# EAGLE design PoE_Mag-revF (EAGLE 8.6.3)
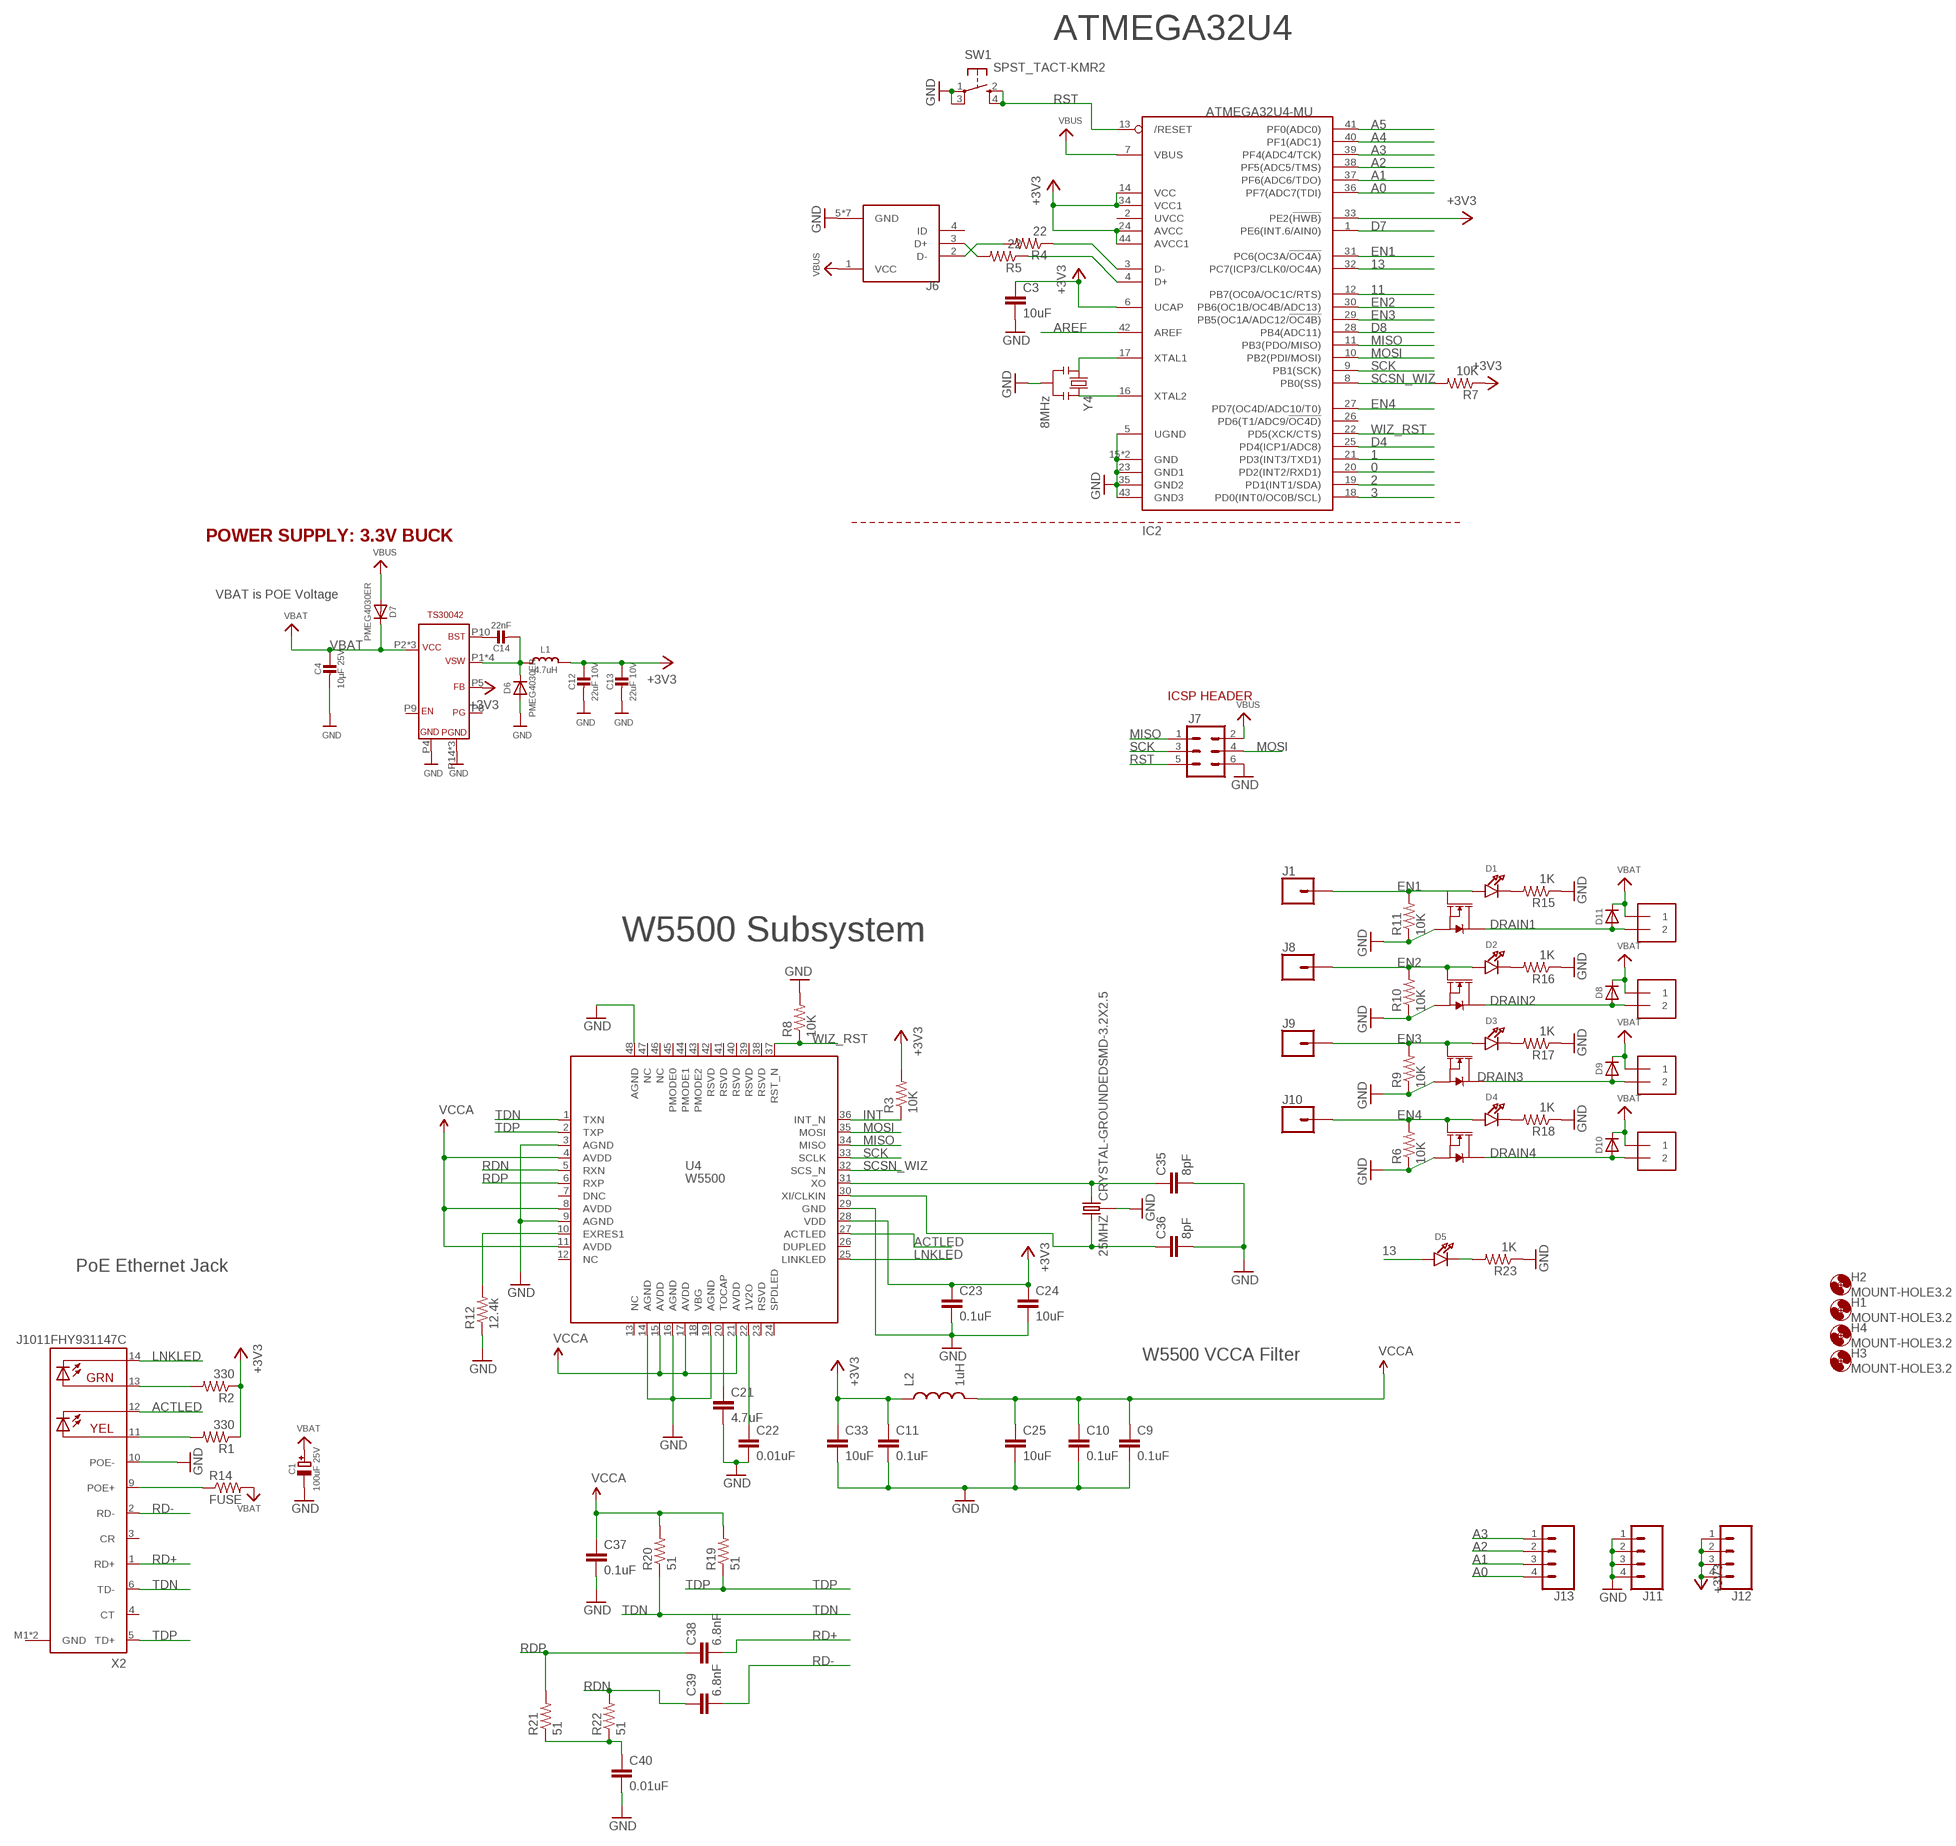
[diagram p0: schematic, sheet 1]

## Parts
25MHZ  CRYSTAL-GROUNDEDSMD-3.2X2.5  [CRYSTAL-SMD-3.2X2.5MM]
C1  100uF 25V  CAP_ELECTROLYTICPANASONIC_D  [PANASONIC_D]
C3  10uF  CAP0603-CAP  [0603-CAP]
C4  10µF 25V  CAP_CERAMIC0603MINI  [0603-MINI]
C9  0.1uF  CAP0603-CAP  [0603-CAP]
C10  0.1uF  CAP0603-CAP  [0603-CAP]
C11  0.1uF  CAP0603-CAP  [0603-CAP]
C12  22uF 10V  CAP_CERAMIC0603MINI  [0603-MINI]
C13  22uF 10V  CAP_CERAMIC0603MINI  [0603-MINI]
C14  22nF  CAP_CERAMIC0603MINI  [0603-MINI]
C21  4.7uF  CAP0603-CAP  [0603-CAP]
C22  0.01uF  CAP0603-CAP  [0603-CAP]
C23  0.1uF  CAP0603-CAP  [0603-CAP]
C24  10uF  CAP0603-CAP  [0603-CAP]
C25  10uF  CAP0603-CAP  [0603-CAP]
C33  10uF  CAP0603-CAP  [0603-CAP]
C35  8pF  CAP0603-CAP  [0603-CAP]
C36  8pF  CAP0603-CAP  [0603-CAP]
C37  0.1uF  CAP0603-CAP  [0603-CAP]
C38  6.8nF  CAP0603-CAP  [0603-CAP]
C39  6.8nF  CAP0603-CAP  [0603-CAP]
C40  0.01uF  CAP0603-CAP  [0603-CAP]
D1  LED0805_NOOUTLINE  [CHIPLED_0805_NOOUTLINE]
D2  LED0805_NOOUTLINE  [CHIPLED_0805_NOOUTLINE]
D3  LED0805_NOOUTLINE  [CHIPLED_0805_NOOUTLINE]
D4  LED0805_NOOUTLINE  [CHIPLED_0805_NOOUTLINE]
D5  LED0805_NOOUTLINE  [CHIPLED_0805_NOOUTLINE]
D6  PMEG4030ER  DIODESOD-123  [SOD-123]
D7  PMEG4030ER  DIODESOD-123  [SOD-123]
D8  DIODESOD-123  [SOD-123]
D9  DIODESOD-123  [SOD-123]
D10  DIODESOD-123  [SOD-123]
D11  DIODESOD-123  [SOD-123]
H1  MOUNT-HOLE3.2  [3,2]
H2  MOUNT-HOLE3.2  [3,2]
H3  MOUNT-HOLE3.2  [3,2]
H4  MOUNT-HOLE3.2  [3,2]
IC2  ATMEGA32U4-MU  [TQFN44_7MM]
J1  CONN_01  [1X01]
J2  1X2-3.5MM  [1X2-3.5MM]
J3  1X2-3.5MM  [1X2-3.5MM]
J4  1X2-3.5MM  [1X2-3.5MM]
J5  1X2-3.5MM  [1X2-3.5MM]
J6  10103594-0001LF  [FCI_10103594-0001LF]
J7  CONN_03X2NO_SILK  [2X3-NS]
J8  CONN_01  [1X01]
J9  CONN_01  [1X01]
J10  CONN_01  [1X01]
J11  CONN_04  [1X04]
J12  CONN_04  [1X04]
J13  CONN_041X04_NO_SILK  [1X04_NO_SILK]
L1  4.7uH  INDUCTORTDK_VLC5045  [INDUCTOR_5X5MM_TDK_VLC5045]
L2  1uH  INDUCTOR0603  [0603]
Q1  35A/25V/8.5mΩ  MOSFET-NCH-FDD8780  [DPAK]
Q3  35A/25V/8.5mΩ  MOSFET-NCH-FDD8780  [DPAK]
Q5  35A/25V/8.5mΩ  MOSFET-NCH-FDD8780  [DPAK]
Q6  35A/25V/8.5mΩ  MOSFET-NCH-FDD8780  [DPAK]
R1  330  RESISTOR0603-RES  [0603-RES]
R2  330  RESISTOR0603-RES  [0603-RES]
R3  10K  RESISTOR0603-RES  [0603-RES]
R4  22  RESISTOR0603-RES  [0603-RES]
R5  22  RESISTOR0603-RES  [0603-RES]
R6  10K  RESISTOR0603-RES  [0603-RES]
R7  10K  RESISTOR0603-RES  [0603-RES]
R8  10K  RESISTOR0603-RES  [0603-RES]
R9  10K  RESISTOR0603-RES  [0603-RES]
R10  10K  RESISTOR0603-RES  [0603-RES]
R11  10K  RESISTOR0603-RES  [0603-RES]
R12  12.4k  RESISTOR0603-RES  [0603-RES]
R14  FUSE  RESISTOR0603-RES  [0603-RES]
R15  1K  RESISTOR0603-RES  [0603-RES]
R16  1K  RESISTOR0603-RES  [0603-RES]
R17  1K  RESISTOR0603-RES  [0603-RES]
R18  1K  RESISTOR0603-RES  [0603-RES]
R19  51  RESISTOR0603-RES  [0603-RES]
R20  51  RESISTOR0603-RES  [0603-RES]
R21  51  RESISTOR0603-RES  [0603-RES]
R22  51  RESISTOR0603-RES  [0603-RES]
R23  1K  RESISTOR0603-RES  [0603-RES]
SW1  SPST_TACT-KMR2  [KMR2]
U4  W5500  [W5500]
U$19  BUCK_CONVERTER  [QFN-16]
X2  J1011FHY931147C  [HANRUN_POE]
Y4  8MHz  RESONATORSMD  [RESONATOR-SMD]

## Nets
0: IC2.20(PD2(INT2/RXD1))
1: IC2.21(PD3(INT3/TXD1))
2: IC2.19(PD1(INT1/SDA))
3: IC2.18(PD0(INT0/OC0B/SCL))
11: IC2.12(PB7(OC0A/OC1C/RTS))
13: D5.A IC2.32(PC7(ICP3/CLK0/OC4A))
+3V3: C3.1 C11.1 C12.1 C13.1 C23.1 C24.1 C33.1 IC2.6(UCAP) IC2.14(VCC) IC2.24(AVCC) IC2.33(PE2(!HWB)) IC2.34(VCC1) IC2.44(AVCC1) J12.1 J12.2 J12.3 J12.4 L1.P$2 L2.1 R1.1 R2.1 R3.2 R7.1 U4.28(VDD) U$19.P5(FB)
A0: IC2.36(PF7(ADC7(TDI)) J13.4
A1: IC2.37(PF6(ADC6/TDO)) J13.3
A2: IC2.38(PF5(ADC5/TMS)) J13.2
A3: IC2.39(PF4(ADC4/TCK)) J13.1
A4: IC2.40(PF1(ADC1))
A5: IC2.41(PF0(ADC0))
ACTLED: U4.27(ACTLED) X2.12(YEL-C)
AREF: IC2.42(AREF)
D4: IC2.25(PD4(ICP1/ADC8))
D7: IC2.1(PE6(INT.6/AIN0))
D8: IC2.28(PB4(ADC11))
D+: IC2.4(D+) R5.1
D-: IC2.3(D-) R4.1
DRAIN1: D11.A J2.2 Q1.4(D)
DRAIN2: D8.A J3.2 Q3.4(D)
DRAIN3: D9.A J4.2 Q5.4(D)
DRAIN4: D10.A J5.2 Q6.4(D)
EN1: D1.A IC2.31(PC6(OC3A/!OC4A)) J1.1 Q1.1(G) R11.2
EN2: D2.A IC2.30(PB6(OC1B/OC4B/ADC13)) J8.1 Q3.1(G) R10.2
EN3: D3.A IC2.29(PB5(OC1A/ADC12/!OC4B)) J9.1 Q5.1(G) R9.2
EN4: D4.A IC2.27(PD7(OC4D/ADC10/T0)) J10.1 Q6.1(G) R6.2
GND: 25MHZ.2 25MHZ.4 C1.- C3.2 C4.2 C9.2 C10.2 C11.2 C12.2 C13.2 C21.2 C22.2 C23.2 C24.2 C25.2 C33.2 C35.2 C36.2 C37.2 C40.2 D6.A IC2.5(UGND) IC2.15(GND) IC2.23(GND1) IC2.35(GND2) IC2.43(GND3) IC2.THERMAL(GND) J6.5(GND) J6.P1(GND) J6.P2(GND) J6.P3(GND) J6.P4(GND) J6.P5(GND) J6.P6(GND) J7.6 J11.1 J11.2 J11.3 J11.4 Q1.3(S) Q3.3(S) Q5.3(S) Q6.3(S) R6.1 R8.2 R9.1 R10.1 R11.1 R12.1 R15.1 R16.1 R17.1 R18.1 R23.1 SW1.1(P) SW1.3(P1) U4.3(AGND) U4.9(AGND) U4.14(AGND) U4.16(AGND) U4.19(AGND) U4.29(GND) U4.48(AGND) U$19.P4(GND) U$19.P14(PGND) U$19.P15(PGND) U$19.PAD(PGND) X2.10(POE-) Y4.2
INT: R3.1 U4.36(INT_N)
LNKLED: U4.25(LINKLED) X2.14(GRN-C)
MISO: IC2.11(PB3(PDO/MISO)) J7.1 U4.34(MISO)
MOSI: IC2.10(PB2(PDI/MOSI)) J7.4 U4.35(MOSI)
N$2: R14.1 X2.9(POE+)
N$3: R2.2 X2.13(GRN-A)
N$4: R1.2 X2.11(YEL-A)
N$5: D1.C R15.2
N$6: J6.3(D+) R5.2
N$7: D2.C R16.2
N$8: D3.C R17.2
N$9: D4.C R18.2
N$10: D5.C R23.2
N$11: IC2.16(XTAL2) Y4.3
N$12: IC2.17(XTAL1) Y4.1
N$13: J6.2(D-) R4.2
N$14: C14.1 U$19.P10(BST)
N$16: C14.2 D6.C L1.P$1 U$19.P1(VSW) U$19.P12(VSW) U$19.P13(VSW) U$19.P16(VSW)
N$18: C21.1 U4.20(TOCAP)
N$19: C22.1 U4.22(1V2O)
N$20: R12.2 U4.10(EXRES1)
N$23: C40.1 R21.1 R22.1
N$25: 25MHZ.3 C35.1 U4.31(XO)
N$26: 25MHZ.1 C36.1 U4.30(XI/CLKIN)
RD+: C38.2 X2.1(RD+)
RD-: C39.2 X2.2(RD-)
RDN: C39.1 R22.2 U4.5(RXN)
RDP: C38.1 R21.2 U4.6(RXP)
RST: IC2.13(/RESET) J7.5 SW1.2(S) SW1.4(S1)
SCK: IC2.9(PB1(SCK)) J7.3 U4.33(SCLK)
SCSN_WIZ: IC2.8(PB0(SS)) R7.2 U4.32(SCS_N)
TDN: R20.1 U4.1(TXN) X2.6(TD-)
TDP: R19.1 U4.2(TXP) X2.5(TD+)
VBAT: C1.+ C4.1 D7.C D8.C D9.C D10.C D11.C J2.1 J3.1 J4.1 J5.1 R14.2 U$19.P2(VCC) U$19.P3(VCC) U$19.P11(VCC)
VBUS: D7.A IC2.7(VBUS) J6.1(VCC) J7.2
VCCA: C9.1 C10.1 C25.1 C37.1 L2.2 R19.2 R20.2 U4.4(AVDD) U4.8(AVDD) U4.11(AVDD) U4.15(AVDD) U4.17(AVDD) U4.21(AVDD)
WIZ_RST: IC2.22(PD5(XCK/CTS)) R8.1 U4.37(RST_N)
Unconnected: IC2.2(UVCC) IC2.26(PD6(T1/ADC9/!OC4D)) J6.4(ID) U4.7(DNC) U4.12(NC) U4.13(NC) U4.18(VBG) U4.23(RSVD) U4.24(SPDLED) U4.26(DUPLED) U4.38(RSVD) U4.39(RSVD) U4.40(RSVD) U4.41(RSVD) U4.42(RSVD) U4.43(PMODE2) U4.44(PMODE1) U4.45(PMODE0) U4.46(NC) U4.47(NC) U$19.P8(PG) U$19.P9(EN) X2.3(CR) X2.4(CT)

## Notes on the sheet
- ATMEGA32U4
- POWER SUPPLY: 3.3V BUCK
- VBAT is POE Voltage
- ICSP HEADER
- W5500 Subsystem
- PoE Ethernet Jack
- W5500 VCCA Filter

## Power pins joined to a net without a drawn wire
GND: X2.M1(GND) X2.M2(GND)

## Library data of the parts
25MHZ = SparkFun-Clocks:CRYSTAL-GROUNDED: Crystals w/ Ground Pin (Generic) These are passive quartz crystals, which can be used as a clock source for a microcontroller. Crystal's are usually two-terminal devices. A third terminal may be optionally connected to ground, as recommended by the manufaturer.
C1 = microbuilder:CAP_ELECTROLYTIC: Electrolytic Capacitors SMT PANASONIC_C - Size C Panasonic Electrolytic Aluminum Capacitor 47µF 16V 20% Electrolytic Capacitor [Digikey: PCE3890TR-ND] PANASONIC_D - Size D Panasonic Electrolytic Aluminum Capacitor 100µF 25V 20% Electrolytic Capacitor [Digikey: PCE3898TR-ND] PTH 3.5 mm grid, 8 mm diameter ... 3.5 mm grid, 10 mm diameter ...
C3 C9-C11 C21-C25 C33 C35-C40 = SparkFun-Passives:CAP: Capacitor Standard 0603 ceramic capacitor, and 0.1" leaded capacitor.
C4 C12-C14 = microbuilder:CAP_CERAMIC: Ceramic Capacitors For new designs, use the packages preceded by an '_' character since they are more reliable: The following footprints should be used on most boards: _0402 - Standard footprint for regular board layouts _0603 - Standard footprint for regular board layouts _0805 - Standard footprint for regular board layouts _1206 - Standard footprint for regular board layouts For extremely tight-pitch boards where space is at a premium, the following 'micro-pitch' footprints can be used (smaller pads, no silkscreen outline, etc.): _0402MP - Micro-pitch footprint for very dense/compact boards _0603MP - Micro-pitch footprint for very dense/compact boards _0805MP - Micro-pitch footprint for very dense/compact boards _1206MP - Micro-pitch footprint for very dense/compact boards
D1-D5 = microbuilder:LED: LED 0603 - 0603 Surface Mount Package 2mA: Green LED - Low Power (3.9mcd, 2ma, 1.7Vf) - Digikey: 475-2709-2-ND Orange LED - Low Power (9.8mcd, 2ma, 1.8Vf) - Digikey: 475-1194-2-ND Red LED - Low Power (5mcd, 2ma, 1.8Vf) - Digikey: 475-1195-2-ND Yellow LED - Low Power (7mcd, 2ma, 1.8Vf) - Digikey: 475-1196-2-ND 5mA: Blue LED - Low Power (17mcd, 5ma, 2.9Vf) - Digikey: LNJ937W8CRACT-ND 0805 - 0805 Surface Mount Package 2mA: Red LED (8.8mcd, 2mA, 1.8Vf, Clear) - Low Power [Digikey: 475-2510-1-ND] Green LED (5mcd, 2mA, 1.8Vf, Clear) - Low Power [Digikey: 475-2730-1-ND] Yellow LED (11.3mcd, 2mA, 1.8Vf, Clear) - Low Power [Digikey: 475-2555-1-ND] 20mA: Red LED (104mcd, 20mA, Diffused) - LS R976 [Digikey: 475-1278-6-ND] Red LED (12mcd, 20mA, 2.0Vf, Clear) - APT2012EC [Digikey: 754-1128-1-ND] Green LED (15mcd, 20mA, 2.2Vf, Clear) - APT2012GC [Digikey: 754-1131-1-ND] Orange LED (160mcd, 20mA, 2.1Vf, Clear) - APT2012SECK [Digikey: 754-1130-1-ND] 1206 - 1206 Surface Mount Package Green LED (26mcd, 20mA, Diffused) - LG N971 [Digikey: 475-1407-6-ND] Red LED (15mcd, 20mA, Diffused) - LH N974 [Digikey: 475-1416-6-ND] Cree - Cree High-Power Surface Mount LEDs XPEBWT-L1-0000-00D50 - White 111lm 350mA 2.9Vf 6200K 110° XTEAWT-00-0000-00000LEE3 - White 114lm 350mA 2.85Vf 5000K 115° Everlight - Everlight 45-21 Series Surface Mount LEDs 45-21/QK2C-B2832AC2CB2/2T - Warm White 2000mcd 20mA 3.25Vf 3050K 120° 45-21/LK2C-B38452C4CB2/2T - Nuetral White 2000mcd 20mA 3.25Vf 4150K 120° 45-21/LK2C-B50634C6CB2/2T - Cold White 2200mcd 20mA 3.25Vf 5650K 120° PLCC2 Reverse Mount LS T77K-J1L2-1-0-2-R18-Z - Red 11.25mcd 2mA 1.8Vf 630nm 120° LO T77K-L1M2-24-Z - Orange 19.6mcd 2mA 1.8Vf 606nm 120° LY T77K-K2M1-26-Z - Yellow 15.7mcd 2mA 1.8Vf 587nm 120°
D6-D11 = microbuilder:DIODE: Diode SMA Model Volts Amps Type Vf Ir Digikey # Notes SSA34-E3 40V 3A Schottky 480mV @ 3A 200uA @ 40V SSA34-E3/61TGITR-ND CDBA120-G 20V 1A Schottky 500mV @ 1A 500uA @ 20V 641-1014-6-ND REEL MBRA210 10V 2A Schottky 350mV @ 2A 700uA @ 10V MBRA210LT3 SOD-123 Model Volts Amps Type Vf Ir Order # Notes BAT54T1G 30V 200mA Schottky 800mV @ 200mA 2uA @ 25V BAT54T1GOSTR-ND B0530W 30V 500mA Schottky 430mV @ 500mA 130uA @ 30V B0530W-FDICT-ND REEL MBR120 20V 1A Schottky 340mV @ 1A MBR120VLSFT1GOSCT-ND SOD-323 Model Volts Amps Type Vf Ir Order # Notes PMEG2005EJ 20V 500mA Schottky 355mV @ 500mA 568-4110-1-ND ZLLS410 10V 570mA Schottky 380mV @ 570mA ZLLS410CT-ND 1N4148WS 75V 150mA Silicon/Simple 1V 1N4148WSFSCT-ND REEL SOD-523 Model Volts Amps Type Vf Ir Order # Notes BAT54XV2 30V 200mA Schottky 0.8V @ 100mA BAT54XV2CT-ND TB751S 30V 30mA Schottky RB751S-40TE61CT-ND SOT23-R/W (R = Solder Paste/Reflow Ovens, W = Hand-Soldering) Model Volts Amps Type Vf Ir Order # Notes BAT54FILM 40V 300mA Schottky 497-7162-1-ND POWERDI-5 Model Volts Amps Type Vf Ir Order # Notes PDS560 60V 5A Schottky 670mV @ 5A 150uA @ 60V PDS560DICT-ND
H1-H4 = holes:MOUNT-HOLE: MOUNTING HOLE with drill center marker
IC2 = microbuilder:ATMEGA32U4: http://www.ladyada.net/library/eagle
J1 J8-J10 = SparkFun-Connectors:CONN_01: Single connection point. Often used as Generic Header-pin footprint for 0.1 inch spaced/style header connections On any of the 0.1 inch spaced packages, you can populate with these: Break Away Headers - Straight <https://www.sparkfun.com/products/116> (PRT-00116) Break Away Male Headers - Right Angle <https://www.sparkfun.com/products/553> (PRT-00553) Female Headers <https://www.sparkfun.com/products/115> (PRT-00115) Break Away Headers - Machine Pin <https://www.sparkfun.com/products/117> (PRT-00117) Break Away Female Headers - Swiss Machine Pin <https://www.sparkfun.com/products/743> (PRT-00743) This device is also useful as a general connection point to wire up your design to another part of your project. Our various solder wires solder well into these plated through hole pads. Hook-Up Wire - Assortment (Stranded, 22 AWG) <https://www.sparkfun.com/products/11375> (PRT-11375) Hook-Up Wire - Assortment (Solid Core, 22 AWG) <https://www.sparkfun.com/products/11367> (PRT-11367) View the entire wire category on our website here <https://www.sparkfun.com/categories/141> Special notes: SMTSO-256-ET is a "flush mount" nut for a 4-40 screw. We mostly use this on specialty testbeds; it is a nice way to connect hardware to your PCB at an adjustable hieght. Also note, the SNAP packages are for using a snappable style connector. We sell a baggie of snaps and they are also used on two LilyPad designs: Snap Assortment - 30 pack (male and female) <https://www.sparkfun.com/products/11347> (DEV-11347) LilyPad Arduino SimpleSnap <https://www.sparkfun.com/products/10941> (DEV-10941) LilyPad SimpleSnap Protoboard <https://www.sparkfun.com/products/10940> (DEV-10940)
J2-J5 = adafruit:1X2: 3.5mm Terminal block http://www.ladyada.net/library/pcb/eaglelibrary.html
J6 = 10103594-0001LF:10103594-0001LF: Conn Micro USB Type B RCP 5 POS 0.65mm Solder RA SMD 5 Terminal 1 Port T/R; AVAILABILITY: Good; DESCRIPTION: Conn Micro USB Type B RCP 5 POS 0.65mm Solder RA SMD 5 Terminal 1 Port T/R; MF: FCI; MP: 10103594-0001LF; PACKAGE: None; PRICE: 0.40 USD
J7 = SparkFun-Connectors:CONN_03X2: Multi connection point. Often used as Generic Header-pin footprint for 0.1 inch spaced/style header connections You can populate with any combo of single row headers, but if you'd like an exact match, check these: Header - 2x3 (Male, 0.1") <https://www.sparkfun.com/products/12807> (PRT-12807) Header - 2x3 (Female, 0.1") <https://www.sparkfun.com/products/13010> (PRT-13010) 2x3 Pin Shrouded Header <https://www.sparkfun.com/products/10877> (PRT-10877) On any of the 0.1 inch spaced packages, you can populate with these: Break Away Headers - Straight <https://www.sparkfun.com/products/116> (PRT-00116) Break Away Male Headers - Right Angle <https://www.sparkfun.com/products/553> (PRT-00553) Female Headers <https://www.sparkfun.com/products/115> (PRT-00115) Break Away Headers - Machine Pin <https://www.sparkfun.com/products/117> (PRT-00117) Break Away Female Headers - Swiss Machine Pin <https://www.sparkfun.com/products/743> (PRT-00743) Special note: the shrouded connector mates well with our 3x2 ribbon cables: Ribbon Crimp Connector - 6-pin (2x3, Female) <https://www.sparkfun.com/products/10651> (PRT-10651) Ribbon Cable - 6 wire (15ft) <https://www.sparkfun.com/products/10646> (PRT-10646)
J11-J13 = SparkFun-Connectors:CONN_04: Multi connection point. Often used as Generic Header-pin footprint for 0.1 inch spaced/style header connections On any of the 0.1 inch spaced packages, you can populate with these: Break Away Headers - Straight <https://www.sparkfun.com/products/116> (PRT-00116) Break Away Male Headers - Right Angle <https://www.sparkfun.com/products/553> (PRT-00553) Female Headers <https://www.sparkfun.com/products/115> (PRT-00115) Break Away Headers - Machine Pin <https://www.sparkfun.com/products/117> (PRT-00117) Break Away Female Headers - Swiss Machine Pin <https://www.sparkfun.com/products/743> (PRT-00743) For SCREWTERMINALS and SPRING TERMINALS visit here: Screw Terimnals on SparkFun.com <https://www.sparkfun.com/search/results?term=Screw+Terminals> (5mm/3.5mm/2.54mm spacing) This device is also useful as a general connection point to wire up your design to another part of your project. Our various solder wires solder well into these plated through hole pads. Hook-Up Wire - Assortment (Stranded, 22 AWG) <https://www.sparkfun.com/products/11375> (PRT-11375) Hook-Up Wire - Assortment (Solid Core, 22 AWG) <https://www.sparkfun.com/products/11367> (PRT-11367) View the entire wire category on our website here <https://www.sparkfun.com/categories/141> Special notes: Molex polarized connector foot print use with SKU : PRT-08231 with associated crimp pins and housings. 1MM SMD Version SKU: PRT-10208; PROD_ID: CONN-09696
L1 = microbuilder:INDUCTOR: Inductors
L2 = SparkFun-Passives:INDUCTOR: Inductors
Q1 Q3 Q5 Q6 = SparkFun-DiscreteSemi:MOSFET-NCH: N-channel MOSFETs Voltage controlled devices that allow control of high current outputs. SparkFun Products: SparkFun OpenScale <https://www.sparkfun.com/products/13261> SparkFun Digital Sandbox <https://www.sparkfun.com/products/12651> SparkFun Monster Moto Shield <https://www.sparkfun.com/products/10182> SparkFun MOSFET Power Controller <https://www.sparkfun.com/products/11214>; PROD_ID: TRANS-09984
R1-R12 R14-R23 = SparkFun-Passives:RESISTOR: Resistor Basic schematic elements and footprints for 0603, 1206, and PTH resistors.
SW1 = adafruit:SPST_TACT: SMT 6mm switch, EVQQ2 series http://www.ladyada.net/library/eagle
U4 = W5500:W5500
U$19 = Heep:BUCK_CONVERTER
X2 = Heep:J1011F: PULSEJACK (TM) 1x1 Tab-UP RJ45 10/100 Base-TX RJ45 1x1 Tab-UP with LEDs 8-pin (J1 series) and 6-pin (JP series) integrated magnetics connector, designed to support applications, such as ADSL modems, LAN-on-Motherboard, and Hub and Switches. Source: www.pulseeng.com .. PulseJack-J402.pdf
Y4 = SparkFun:RESONATOR: Resonator Small SMD resonator. This is the itty bitty 10/20MHz resonators with built in caps. CSTCE10M0G55 and CSTCE20M0V53. Footprint has been reviewed closely but hasn't been tested yet.

## Net classes
3 usbvcc: width 0.305 mm, drill 0.483 mm, clearance 0.203 mm

## Board
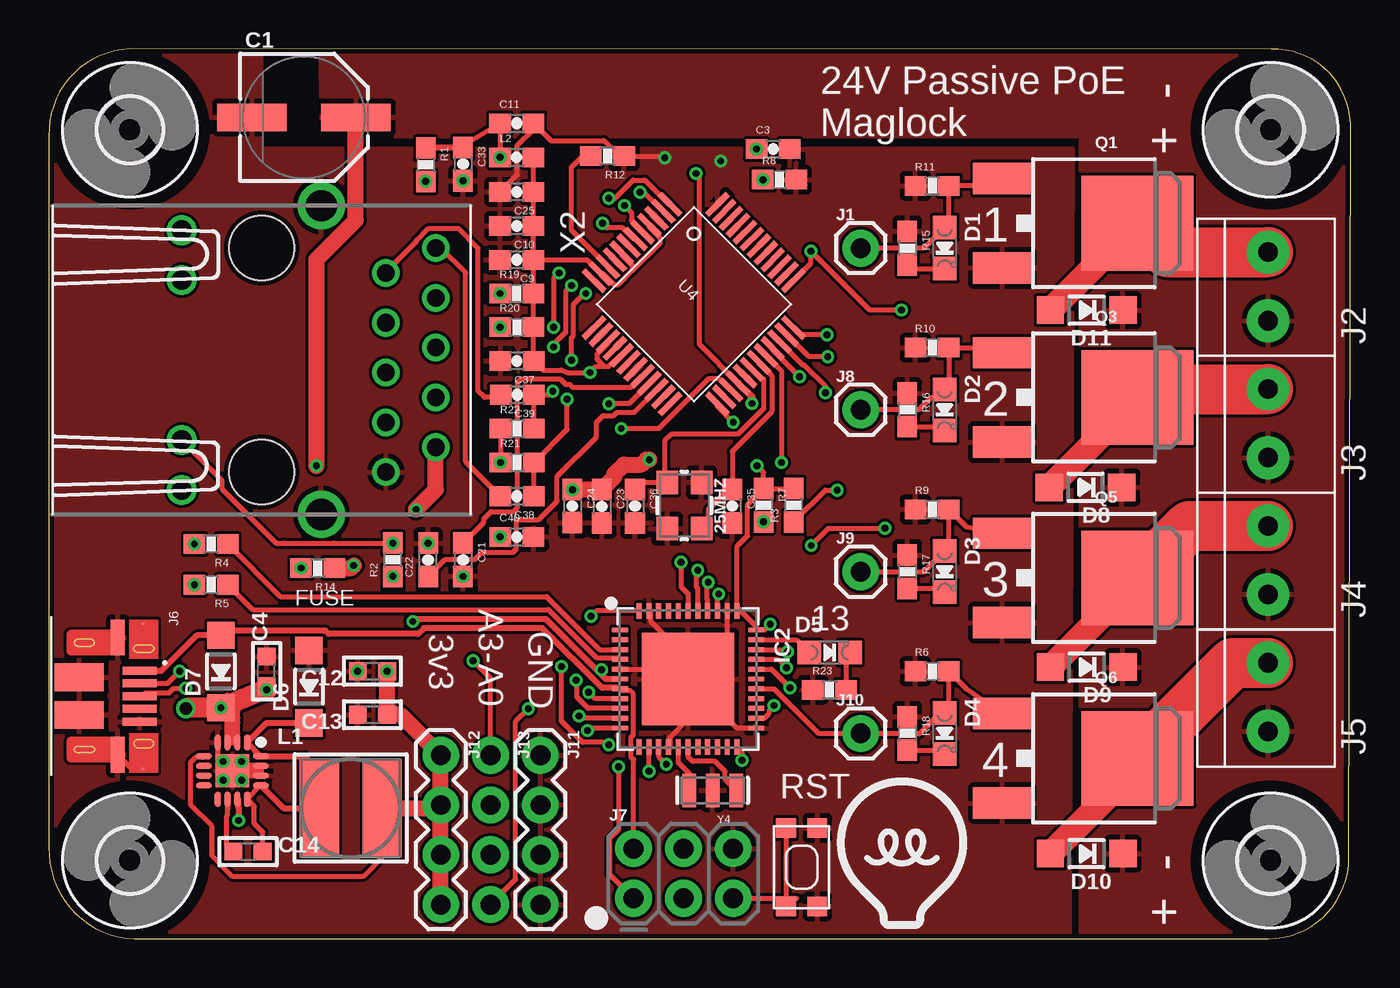
[diagram p1: board, top side]
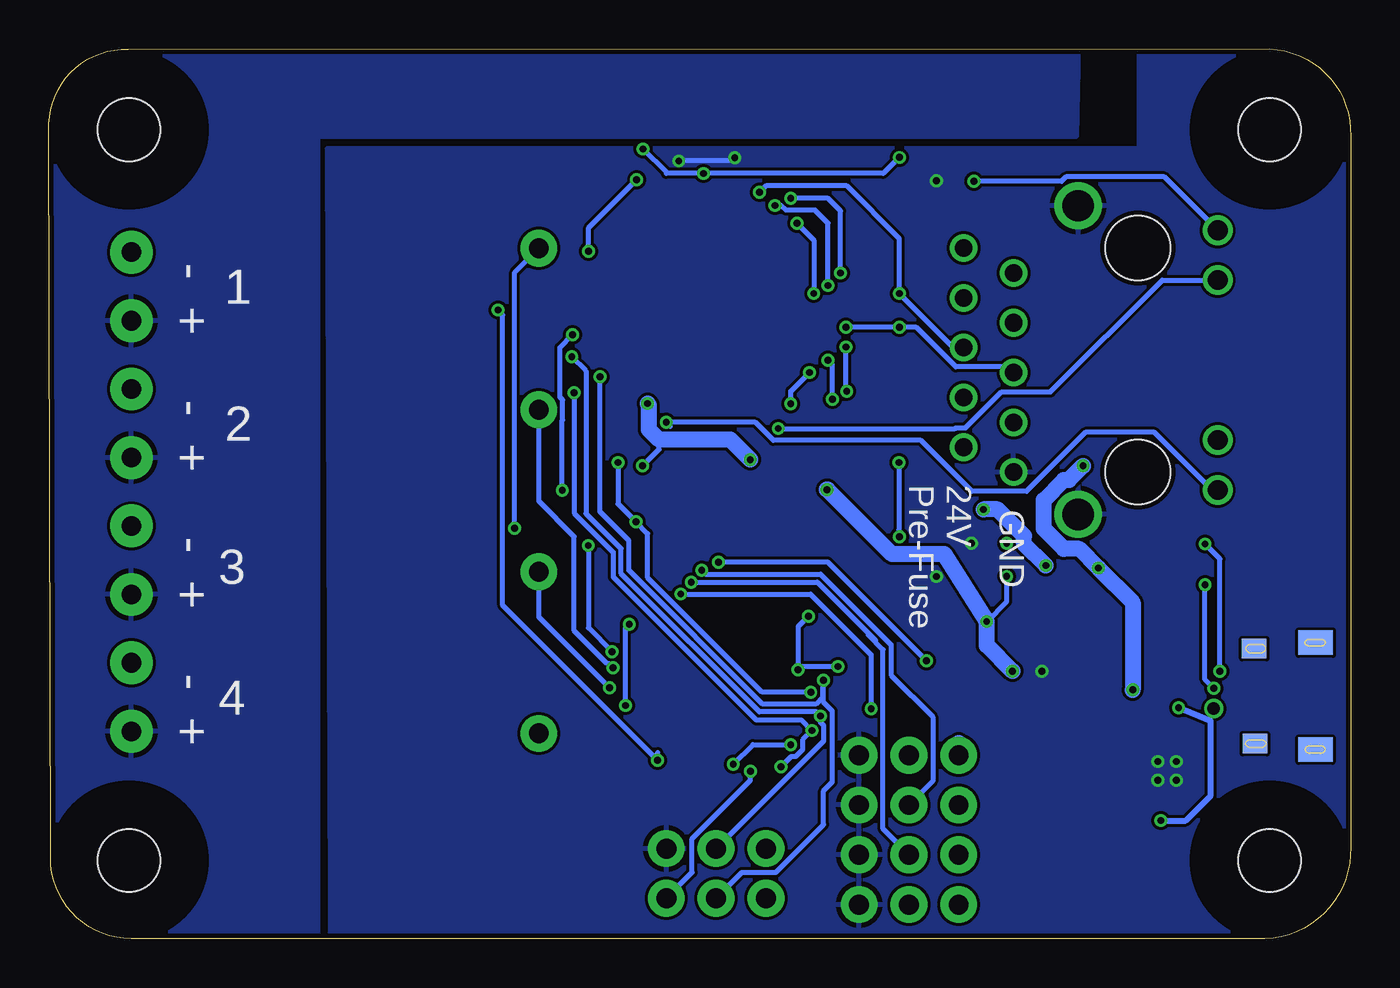
[diagram p2: board, bottom side, seen from below]

Size 66.44 x 45.4 mm. Coordinates in mm from the lower left corner, seen from the top.
Outline: 4.37,0 62.23,0 arc90 66.36,4.13 66.44,41.59 arc90 62.39,45.39 4.13,45.4 arc90 0,40.96 0,4.68 arc90 4.37,0
Copper layers (1*16): Top 0.035mm / dielectric 1.5mm / Bottom 0.035mm
Design rules "SeeedStudio_2layer_DRU_no_angle_20140221": minimum track width 6mil, minimum drill 12mil, track to track 6mil, track to pad 6mil, pad to pad 6mil, via to via 6mil, smd to smd 0mil, copper to edge 10mil, drill to drill 10mil, minimum pad ring 10mil, minimum via ring 6mil, stop-mask expansion 2mil, vias tented up to drill 100mil, thermal gap 10mil

### Footprints (pad centres in the part's own frame; a part is rotated, then mirrored left to right if it is on the bottom)
CRYSTAL-SMD-3.2X2.5MM = smd 1.2 x 1.1: 1 -1.175,-0.875; 2 1.175,-0.875; 3 1.175,0.875; 4 -1.175,0.875
PANASONIC_D = smd 3.556 x 1.4: + 2.654,0; - -2.654,0
0603-CAP = smd 1.1 x 1: 1 -0.85,0; 2 0.85,0
0603-MINI = smd 0.9 x 0.9: 1 -0.75,0; 2 0.75,0
CHIPLED_0805_NOOUTLINE = smd 1.2 x 1.2: A 0,-1.05; C 0,1.05
SOD-123 = smd 1.4 x 1.4: A 1.85,0; C -1.85,0
3,2 = hole 3.2: 0,0
TQFN44_7MM = smd 0.25 x 0.8: 1 -2.5,-3.475; 2 -2,-3.475; 3 -1.5,-3.475; 4 -1,-3.475; 5 -0.5,-3.475; 6 0,-3.475; 7 0.5,-3.475; 8 1,-3.475; 9 1.5,-3.475; 10 2,-3.475; 11 2.5,-3.475; 23 2.5,3.475; 24 2,3.475; 25 1.5,3.475; 26 1,3.475; 27 0.5,3.475; 28 0,3.475; 29 -0.5,3.475; 30 -1,3.475; 31 -1.5,3.475; 32 -2,3.475; 33 -2.5,3.475 | smd 0.8 x 0.25: 12 3.475,-2.5; 13 3.475,-2; 14 3.475,-1.5; 15 3.475,-1; 16 3.475,-0.5; 17 3.475,0; 18 3.475,0.5; 19 3.475,1; 20 3.475,1.5; 21 3.475,2; 22 3.475,2.5; 34 -3.475,2.5; 35 -3.475,2; 36 -3.475,1.5; 37 -3.475,1; 38 -3.475,0.5; 39 -3.475,0; 40 -3.475,-0.5; 41 -3.475,-1; 42 -3.475,-1.5; 43 -3.475,-2; 44 -3.475,-2.5 | smd 4.7 x 4.7: THERMAL 0,0
1X01 = drill 1.016 pad 1.88: 1 0,0
1X2-3.5MM = drill 1 pad 2.184: 1 1.8,0; 2 -1.7,0
FCI_10103594-0001LF = smd 0.4 x 1.75: 1 -1.3,2.825; 2 -0.65,2.825; 3 0,2.825; 4 0.65,2.825; 5 1.3,2.825 | smd 0.1 x 0.1: P1 -3.7,3; P2 3.7,3 | smd 1.825 x 0.7: P3 -2.987,1.7; P4 2.987,1.7 | smd 1.425 x 2.5: P5 -0.963,-0.25; P6 0.963,-0.25 | smd 1.25 x 1.75 bottom: P$1 -2.731,-0.026; P$2 2.726,-0.018 | smd 1 x 1.25 bottom: P$3 -2.422,3.111; P$4 2.427,3.078
2X3-NS = drill 1.016 pad 1.88: 1 -2.54,-1.27; 2 -2.54,1.27; 3 0,-1.27; 4 0,1.27; 5 2.54,-1.27; 6 2.54,1.27
1X04 = drill 1.016 pad 1.88: 1 0,0; 2 2.54,0; 3 5.08,0; 4 7.62,0
1X04_NO_SILK = drill 1.016 pad 1.88: 1 0,0; 2 2.54,0; 3 5.08,0; 4 7.62,0
INDUCTOR_5X5MM_TDK_VLC5045 = smd 2 x 5: P$1 -1.6,0; P$2 1.6,0
0603 = smd 1.1 x 1: 1 -0.85,0; 2 0.85,0
DPAK = smd 1.6 x 3: 1 -2.28,-5.31; 3 2.28,-5.31 | smd 4.826 x 5.715: 4 0,1.588
0603-RES = smd 1.1 x 1: 1 -0.85,0; 2 0.85,0
KMR2 = smd 1 x 1: 1 2,0.8; 2 2,-0.8; 3 -2,0.8; 4 -2,-0.8
W5500 = smd 1.5 x 0.3: 1 -4.45,2.75; 2 -4.45,2.25; 3 -4.45,1.75; 4 -4.45,1.25; 5 -4.45,0.75; 6 -4.45,0.25; 7 -4.45,-0.25; 8 -4.45,-0.75; 9 -4.45,-1.25; 10 -4.45,-1.75; 11 -4.45,-2.25; 12 -4.45,-2.75; 25 4.45,-2.75; 26 4.45,-2.25; 27 4.45,-1.75; 28 4.45,-1.25; 29 4.45,-0.75; 30 4.45,-0.25; 31 4.45,0.25; 32 4.45,0.75; 33 4.45,1.25; 34 4.45,1.75; 35 4.45,2.25; 36 4.45,2.75 | smd 0.3 x 1.5: 13 -2.75,-4.45; 14 -2.25,-4.45; 15 -1.75,-4.45; 16 -1.25,-4.45; 17 -0.75,-4.45; 18 -0.25,-4.45; 19 0.25,-4.45; 20 0.75,-4.45; 21 1.25,-4.45; 22 1.75,-4.45; 23 2.25,-4.45; 24 2.75,-4.45; 37 2.75,4.45; 38 2.25,4.45; 39 1.75,4.45; 40 1.25,4.45; 41 0.75,4.45; 42 0.25,4.45; 43 -0.25,4.45; 44 -0.75,4.45; 45 -1.25,4.45; 46 -1.75,4.45; 47 -2.25,4.45; 48 -2.75,4.45
QFN-16 = smd 0.8 x 0.3: P1 -1.45,0.75; P2 -1.45,0.25; P3 -1.45,-0.25; P4 -1.45,-0.75; P9 1.45,-0.75; P10 1.45,-0.25; P11 1.45,0.25; P12 1.45,0.75 | smd 0.3 x 0.8: P5 -0.75,-1.45; P6 -0.25,-1.45; P7 0.25,-1.45; P8 0.75,-1.45; P13 0.75,1.45; P14 0.25,1.45; P15 -0.25,1.45; P16 -0.75,1.45 | smd 1.7 x 1.7: PAD 0,0
HANRUN_POE = drill 0.9 pad 1.3: 1 5.715,-8.89; 2 4.445,-6.35; 3 3.175,-8.89; 4 1.905,-6.35; 5 0.635,-8.89; 6 -0.635,-6.35; 7 -1.905,-8.89; 8 -3.175,-6.35; 9 -4.445,-8.89; 10 -5.715,-6.35 | drill 1 pad 1.422: 11 6.625,4.08; 12 4.085,4.08; 13 -4.085,4.08; 14 -6.625,4.08 | drill 1.6 pad 2.184: M1 7.875,-3.05; M2 -7.875,-3.05 | hole 3.3: -5.715,0; 5.715,0
RESONATOR-SMD = smd 0.7 x 1.7: 1 -1.2,0; 2 0,0; 3 1.2,0

### Placement (x,y rotation side)
25MHZ  32.44,22.11 270 top
C1  13.02,41.91 0 top
C3  36.97,40.3 0 top
C4  11.11,13.65 90 top
C9  23.88,34.65 180 top
C10  23.88,36.38 180 top
C11  23.88,41.61 0 top
C12  16.51,13.65 180 top
C13  16.51,11.43 180 top
C14  10.16,4.45 0 top
C21  21.13,19.34 270 top
C22  19.36,19.34 90 top
C23  28.22,22.07 270 top
C24  26.72,22.08 270 top
C25  23.88,38.11 180 top
C33  21.13,39.53 270 top
C35  34.88,22.07 270 top
C36  29.91,22.07 270 top
C37  23.89,29.48 180 top
C38  23.89,22.58 180 top
C39  23.91,27.76 180 top
C40  23.88,20.51 0 top
D1  45.72,35.24 180 top
D2  45.72,26.99 180 top
D3  45.72,18.73 180 top
D4  45.72,10.48 180 top
D5  39.85,14.6 270 top
D6  13.27,12.87 90 top
D7  8.78,13.64 90 top
D8  52.91,23.03 180 top
D9  52.97,13.87 180 top
D10  52.97,4.34 180 top
D11  52.97,32.08 180 top
H1  62.35,41.28 0 top
H2  4.13,4 270 top
H3  4.13,41.28 0 top
H4  62.35,4 0 top
IC2  32.62,13.25 270 top
J1  41.43,35.24 0 top
J2  62.23,33.34 270 top
J3  62.23,26.35 270 top
J4  62.23,19.37 270 top
J5  62.23,12.38 270 top
J6  1.8,12.38 270 top
J7  32.38,3.33 0 top
J8  41.43,26.99 0 top
J9  41.43,18.73 0 top
J10  41.43,10.48 0 top
J11  25.08,9.37 270 top
J12  20,9.37 270 top
J13  22.54,9.37 270 top
L1  15.4,6.67 0 top
L2  23.88,39.87 0 top
Q1  53.98,36.51 270 top
Q3  53.98,27.62 270 top
Q5  53.98,18.42 270 top
Q6  53.98,9.21 270 top
R1  19.23,39.5 270 top
R2  17.55,19.34 90 top
R3  38.01,22.12 90 top
R4  8.28,20.14 180 top
R5  8.28,18.07 180 top
R6  45.09,13.65 0 top
R7  36.48,22.12 270 top
R8  37.29,38.73 0 top
R9  45.09,21.91 0 top
R10  45.09,30.16 0 top
R11  45.09,38.42 0 top
R12  28.51,39.94 180 top
R14  13.72,18.92 180 top
R15  43.81,35.24 270 top
R16  43.81,26.99 270 top
R17  43.81,18.73 270 top
R18  43.81,10.48 270 top
R19  23.88,32.92 0 top
R20  23.88,31.21 0 top
R21  23.9,24.3 0 top
R22  23.9,26.03 0 top
R23  39.85,12.7 0 top
SW1  38.42,3.65 270 top
U4  32.91,32.38 315 top
U$15  [HEEPLOGOSMALL]  39.05,-0.32 0 top
U$19  9.37,8.57 270 top
X2  10.86,29.53 90 top
Y4  33.88,7.57 180 top

### Tracks (layer width: path | path; a pad name or v marks a point on that pad's centre or on a via)
13
  Top 0.254: IC2.32 38.15,15.25 D5.A
+3V3  (via drill 0.35)
  Top 0.254: C33.1 20.97,40.38 C11.1 L2.1 | C24.1 v26.73,22.92 | R7.1 R3.2 | U4.28 33.19,30.34 33.19,38.88 v33.02,39.05 | U$19.P5 7.85,9.25 7.49,9.25 7.24,9 7.24,6.82 8.32,5.74 8.32,4.24 9.38,3.18 16.03,3.18 17.14,4.29 17,4.43 L1.P$2 | R7.1 36.48,23.79 v36.14,24.13 | R7.1 35.66,22.16 35.66,20.56 35.12,20.02 35.12,16.91 | IC2.34 35.12,16.91 | IC2.33 | IC2.33 36.1,15.94 35.12,16.91 | v37,11.9 36.78,11.67 36.78,11.51 36.52,11.25 IC2.24 | v36.82,16.05 36.53,15.76 IC2.33 | IC2.44 27.94,16.73 v27.67,16.46 | v28.2,13.72 28.2,13.55 28.16,13.51 | IC2.14 31.12,9.29 v31.51,8.9 | v28.57,9.9 28.29,10.02 27.24,10.02 26.16,11.1 v26.16,13.89
  Top 0.305: IC2.6 28.42,13.25 28.16,13.51 25.36,16.31 18.7,16.31 v18.57,16.19 | R1.1 19.26,40.38 20.97,40.38
  Top 0.35: 35.88,27.65 U4.28
  Top 0.406: v35.88,27.31 35.88,27.65
  Top 0.813: J12.4 J12.3 | J12.3 J12.2 | J12.2 J12.1 17.94,11.43 C13.1 C12.1 | 19.84,4.13 J12.3 | v26.73,22.92 C23.1 28.85,23.55 28.85,23.71 29.35,24.2 30.25,24.2 30.5,24.45 v30.64,24.45 | L1.P$2 19.84,6.67 J12.2
  Bottom 0.254: v36.14,24.13 35.29,24.98 35.29,25.47 | v37,11.9 37,15.86 v36.82,16.05 | v27.67,16.46 28.2,15.93 v28.2,13.72 28.03,13.89 v26.16,13.89 | v31.51,8.9 30.51,9.9 v28.57,9.9 | R2.1 17.55,17.21 v18.57,16.19 | L2.1 23.84,39.05 v33.02,39.05 34.92,39.05 34.92,39.1 C3.1
  Bottom 0.305: v18.57,16.19
  Bottom 0.813: J12.1 20,10 | v26.73,22.92 26.7,22.92 23.4,19.62 20.73,19.62 v18.57,16.19 | v30.64,24.45 31.66,25.47 35.29,25.47 35.81,25.99 35.81,27.24 v35.88,27.31 | C12.1 18.57,14.97 v18.57,16.19
  other vias: 17.26,13.65 17.55,18.49 23.03,39.87 36.12,40.3
A0  (via drill 0.35)
  Top 0.254: J13.4 23.83,3.03 23.83,11.1 v24.47,11.74 | IC2.36 34.12,17.53 v34.19,17.59
  Bottom 0.254: v34.19,17.59 27.56,17.59 24.47,14.5 v24.47,11.74
A1  (via drill 0.35)
  Top 0.254: IC2.37 33.62,17.3 33.58,17.34 33.58,18.12 v33.65,18.2
  Bottom 0.254: v33.65,18.2 27.22,18.2 24.61,15.59 | 24.61,15.59 24.25,15.22 | 24.61,15.59 24.61,15.5 23.86,14.75 23.86,5.61 J13.3
A2  (via drill 0.35)
  Top 0.254: IC2.38 33.12,17.87 33.04,17.95 33.04,18.45 33.12,18.52 v33.12,18.8
  Bottom 0.254: v33.12,18.8 32.92,18.6 27.05,18.6 23.46,15.01 23.46,13.45 21.32,11.32 21.32,8.05 J13.2
A3  (via drill 0.35)
  Top 0.254: J13.1 22.54,13.28 v21.64,14.18 | v32.27,19.22 32.27,17.95 32.62,17.6 IC2.39
  Bottom 0.254: v21.64,14.18 26.68,19.22 v32.27,19.22
ACTLED  (via drill 0.35)
  Top 0.254: U4.27 34.25,28.57 33.66,28.57 31.12,26.03 v29.21,26.03
  Bottom 0.254: v29.21,26.03 20.18,26.03 20.15,26.07 19.65,26.07 17.81,27.91 15.32,27.91 9.61,33.61 X2.12
D+
  Top 0.254: IC2.4 29.05,14.35 27.94,14.35 25.49,16.8 10.4,16.8 R5.1
D-
  Top 0.254: IC2.3 28.11,14.75 25.4,17.46 11.81,17.46 R4.1
DRAIN1
  Top 1.27: D11.A 55.55,36.51 Q1.4
  Top 2.54: Q1.4 57.04,35.04 J2.2
DRAIN2
  Top 1.27: D8.A 55.56,27.54 Q3.4
  Top 2.54: Q3.4 55.99,28.05 J3.2
DRAIN3
  Top 1.27: D9.A 53.98,16.72 53.98,18.42 Q5.4
  Top 2.54: Q5.4 58.21,21.07 J4.2
DRAIN4
  Top 1.27: D10.A 55.56,8.79 Q6.4
  Top 2.54: Q6.4 60.44,14.08 J5.2
EN1  (via drill 0.35)
  Top 0.254: Q1.1 47.77,38.42 R11.2 45.94,36.51 D1.A 44.67,35.24 J1.1 | IC2.31 37.58,14.75 v37.69,14.65 | v38.91,20.07 39.78,20.94 v42.67,20.94
  Bottom 0.254: v42.67,20.94 42.67,34.01 J1.1 | v38.91,20.07 38.91,15.86 v37.69,14.65
EN2  (via drill 0.35)
  Top 0.254: J8.1 41.45,27.01 44.43,27.01 45.05,27.62 45.3,27.62 D2.A 45.94,28.25 R10.2 47.77,30.16 Q3.1 | IC2.30 37.23,14.25 v37.65,13.83
  Bottom 0.254: v37.65,13.83 37.86,14.04 37.94,14.04 39.62,15.72 39.62,20.52 41.43,22.33 J8.1
EN3  (via drill 0.35)
  Top 0.254: J9.1 44.67,18.73 D3.A 45.94,20 R9.2 46.83,21.01 Q5.1 | IC2.29 36.87,13.75 v37.82,12.8
  Bottom 0.254: v37.82,12.8 41.43,16.42 J9.1
EN4
  Top 0.254: Q6.1 46.83,12.76 R6.2 45.94,11.74 D4.A 45.5,11.53 44.43,10.46 41.45,10.46 J10.1 41.42,10.49 39.27,10.49 37.01,12.75 IC2.27
GND  (via drill 0.35)
  Top 0.254: U$19.P4 8.62,9.32 v8.89,9.05 | v31.43,39.85 31.34,39.94 R12.1 29.1,39.94 28.33,40.72 25.62,40.72 C11.2 24.73,41.32 23.9,40.49 23.9,38.98 C25.2 | IC2.5 32.12,13.75 IC2.THERMAL | IC2.43 30.72,16.63 30.72,16.21 32.62,14.31 IC2.THERMAL | IC2.35 34.62,15.25 IC2.THERMAL | IC2.23 35.12,10.75 IC2.THERMAL | IC2.15 31.71,9.87 31.71,10.29 32.62,11.2 IC2.THERMAL | J6.P4 4.22,8.68 J6.P2
  Top 0.305: v9.84,8.1 10.07,8.32 U$19.P14 U$19.P15 | U$19.PAD 10.57,8.57 U$19.P15 | U$19.P15 10.07,8.82 v9.84,9.05
  Bottom 0.254: v31.43,39.85 31.59,39.69 v34.29,39.69 | C21.2 21.2,18.49 21.27,18.42
  other vias: 8.89,8.1 21.13,18.49 19.36,20.19 15.76,13.65 21.13,38.68
  pour Top (rank 2): -8.1,46.67 10.79,46.67 10.79,40.32 52.23,40.32 52.07,-4.45 -8.26,-4.45
  pour Bottom (rank 2): -8.1,46.67 10.79,46.67 10.79,40.32 52.23,40.32 52.07,-4.45 -8.26,-4.45
INT  (via drill 0.35)
  Top 0.254: R3.1 39.63,22.89 v40.24,22.89 | v39.7,30.81 38.37,30.81 U4.36
  Bottom 0.254: v40.24,22.89 40.24,26.46 40.21,26.48 40.21,27.49 40.36,27.64 40.36,30.16 v39.7,30.81
LNKLED  (via drill 0.35)
  Top 0.254: v34.92,26.35 34.12,27.16 U4.25
  Bottom 0.254: 34.73,26.15 v34.92,26.35 30.39,26.35 29.46,25.43 21.94,25.43 19.34,22.83 16.54,22.83 16.24,23.13 | 16.23,23.12 16.24,23.13 | X2.14 7.07,22.9 10.01,25.84 13.53,25.84 16.24,23.13
MISO  (via drill 0.35)
  Top 0.254: IC2.11 27.62,10.75 v27.49,10.63 | U4.34 38.5,29.28 38.56,29.28 39.63,28.21 v39.63,27.86 | v29.06,8.78 29.06,5.55 28.63,5.11 28.63,3.28 J7.1
  Bottom 0.254: v39.63,27.86 39.63,21.72 37.64,19.74 37.64,18.47 30.34,11.17 28.03,11.17 v27.49,10.63 27.97,10.15 27.97,9.65 28.32,9.3 28.55,9.3 v29.06,8.78
MOSI  (via drill 0.35)
  Top 0.254: IC2.10 27.17,11.25 v27.05,11.37 | U4.35 37.68,30.83 38.8,29.71 v39.75,29.71
  Bottom 0.254: v39.75,29.71 39.02,28.98 39.02,21.69 37.24,19.9 37.24,18.63 30.18,11.57 27.26,11.57 v27.05,11.37 27.05,11.04 26.89,10.88 26.89,10.1 J7.4
N$2  (via drill 0.35)
  Top 0.813: R14.1 15.43,18.92 v15.56,19.05 | v18.73,21.91 19.75,22.92 X2.9
  Bottom 0.813: v15.56,19.05 16.67,20.16 16.67,20.56 18.02,21.91 v18.73,21.91
N$3  (via drill 0.35)
  Top 0.254: X2.13 8.82,23.39 8.82,22.97 11.61,20.19 12.03,20.19 12.04,20.17 14.52,20.17 14.53,20.19 R2.2
  other vias: 17.55,20.19
N$4  (via drill 0.35)
  Bottom 0.254: R1.2 14.75,38.65 14.52,38.88 9.5,38.88 X2.11
  other vias: 19.23,38.65
N$5
  Top 0.254: R15.2 44.02,34.19 D1.C
N$6  (via drill 0.35)
  Top 0.254: J6.3 4.9,12.55 6.14,12.55 6.37,12.77 v6.98,12.77
  Bottom 0.254: v6.98,12.77 7.43,13.22 R5.2
  other vias: 7.43,18.07
N$7
  Top 0.254: R16.2 45.52,26.14 D2.C
N$8
  Top 0.254: R17.2 45.52,17.88 D3.C
N$9
  Top 0.254: R18.2 45.52,9.63 D4.C
N$10
  Top 0.254: R23.2 40.7,14.41 D5.C
N$11
  Top 0.254: IC2.16 32.12,8.99 32.7,8.41 32.7,7.59 Y4.3
N$12
  Top 0.254: Y4.1 34.51,8.14 34.51,8.54 34,9.05 32.86,9.05 32.62,9.29 IC2.17
N$13  (via drill 0.35)
  Top 0.254: J6.2 6.05,13.03 v6.67,13.65
  Bottom 0.254: v6.67,13.65 6.67,19.39 R4.2
  other vias: 7.43,20.14
N$14
  Top 0.254: 9.12,6.58 U$19.P10 9.12,6.32 9.08,6.28 9.08,4.78 C14.1
N$16
  Top 0.254: U$19.P13 U$19.P12 10.48,6.76 10.48,5.87 10.91,5.44 C14.2
  Top 0.305: D6.C 11.11,11.02 U$19.P1 U$19.P16 13.06,9.32 13.81,8.57 13.8,8.56 L1.P$1 11.97,6.67 U$19.P13
N$18
  Top 0.254: C21.1 22.2,21.26 22.2,21.44 22.56,21.8 23.7,21.8 23.91,22 23.91,28.4 24.09,28.57 26.08,28.57 26.37,28.29 26.57,28.29 26.71,28.15 29.73,28.15 U4.20
N$19
  Top 0.254: C22.1 20.23,19.36 21.75,19.36 22.12,19.73 23.7,19.73 23.86,19.89 23.86,21.39 25,21.39 25.94,22.33 25.94,23.6 27.94,25.6 27.94,26.35 28.29,26.7 28.83,26.7 28.99,26.86 29.87,26.86 U4.22
N$20
  Top 0.254: U4.10 26.67,36.15 26.67,39.37 27.24,39.94 R12.2
N$23  (via drill 0.35)
  Top 0.254: R22.1 R21.1
  Bottom 0.254: R21.1 23.05,20.85 C40.1
  other vias: 23.05,24.3 23.03,20.51
N$25
  Top 0.254: C35.1 35.27,23.32 | U4.31 36.24,29.38 36.9,28.72 36.9,26.89 34.88,24.87 C35.1 | 25MHZ.3 33.66,21.28 33.66,21.91 34.67,22.92 C35.1
N$26
  Top 0.254: C36.1 30.27,23.28 31.43,23.28 | 31.43,23.28 25MHZ.1 | U4.30 36.39,28.55 36.49,28.55 36.49,27.06 35.18,25.75 31.78,25.75 31.43,25.4 31.43,23.28
RD+
  Top 0.254: C38.2 21.27,24.34 21.27,33.97 20,35.24 X2.1
RD-
  Top 0.254: C39.2 22.92,27.62 22.23,27.62 21.91,27.94 21.91,35.24 20.92,36.23 19.34,36.23 18.76,35.65 18.76,35.59 17.2,34.03 X2.2
RDN  (via drill 0.35)
  Top 0.254: R22.2 C39.1 | C39.1 24.94,27.94 | U4.5 30.3,36.09 29.73,36.66 29.73,37.06 v29.38,37.41 | v25.75,30.2 25.75,30.33 26.37,30.95 26.37,33.04 v26.67,33.34 | C39.1 25.54,27.76 v25.72,27.94
  Bottom 0.254: v26.67,33.34 26.67,36.51 27.33,37.18 28.83,37.18 29.06,37.41 v29.38,37.41 | v25.72,27.94 25.75,27.98 v25.75,30.2
RDP  (via drill 0.35)
  Top 0.254: C38.1 24.75,22.59 R21.2 26.45,26 v26.45,27.53 | U4.6 29.84,35.71 29.28,36.27 28.5,36.27 v28.26,36.51 | v26.67,29.53 26.67,30.67 26.78,30.78 26.78,32.39 27.32,32.93 v27.4,32.93
  Bottom 0.254: v28.26,36.51 27.4,35.65 v27.4,32.93 | v26.45,27.53 26.45,29.3 v26.67,29.53
RST  (via drill 0.35)
  Top 0.254: J7.5 38.16,2.06 SW1.2 SW1.4 | v30.63,8.54 30.63,9.77 IC2.13
  Bottom 0.254: J7.5 33.6,3.38 33.6,5.11 30.63,8.08 v30.63,8.54
SCK  (via drill 0.35)
  Top 0.254: v26.9,13.19 26.94,13.15 26.94,12.33 27.52,11.75 IC2.9 | v38.31,28.67 36.94,30.04 U4.33
  Bottom 0.254: v38.31,28.67 38.31,21.8 36.83,20.32 36.83,18.8 30.01,11.98 27.3,11.98 26.94,12.33 26.94,13.15 v26.9,13.19 26.9,12.07 26.45,11.62 26.45,8 26.9,7.55 26.9,5.82 29.34,3.38 31.06,3.38 J7.3
SCSN_WIZ  (via drill 0.35)
  Top 0.254: IC2.8 27.88,12.25 v27.55,12.59 | U4.32 37.39,28.97 v37.39,24.3
  Bottom 0.254: v27.55,12.59 30.04,12.59 35.88,18.42 35.88,20.68 R7.2 37.39,22.19 v37.39,24.3
  other vias: 36.48,21.27
TDN  (via drill 0.35)
  Top 0.254: R20.1 v23.02,31.2 | U4.1 31.64,37.48 30.41,38.71 29.82,38.71 28.89,37.78 v28.58,37.78 | v26.04,33.97 25.76,33.7 v25.76,31.2
  Bottom 0.254: 25.8,31.2 v25.76,31.2 v23.02,31.2 22.17,31.2 20.15,29.18 17.49,29.18 X2.6 | v26.04,33.97 26.04,37.15 26.67,37.78 v28.58,37.78
TDP  (via drill 0.35)
  Top 0.254: v30.16,38.1 30.38,38.1 U4.2
  Bottom 0.254: v30.16,38.1 29.84,38.42 25.72,38.42 23.03,35.73 R19.1 20.27,30.16 X2.5
  other vias: 23.03,32.92
VBAT  (via drill 0.35, 0.65)
  Top 0.305: U$19.P11 9.66,7.08 9.66,6.68 9.68,6.66 v9.68,6.03 | 9.12,10.52 U$19.P3 U$19.P2 | 9.12,10.52 9.12,10.8 | 9.12,10.8 9.12,10.95 | 9.12,10.95 9.12,11.27 | 9.12,11.27 9.12,11.59 | 9.12,11.59 9.12,12.4 D7.C 9.41,12.11 | U$19.P2 9.62,10.48 | 9.62,10.48 9.62,11.05 | 9.62,11.05 9.62,11.27 | 9.62,11.27 9.62,11.59 | 9.62,11.59 9.62,11.9 9.41,12.11 | U$19.P2 9.12,10.52 | 9.62,10.48 9.43,10.48 9.24,10.67 | 9.24,10.67 9.12,10.8 | 9.24,10.67 9.62,11.05 | 9.12,10.95 9.43,11.27 9.62,11.27 | 9.12,11.27 9.43,11.59 9.62,11.59 | 9.12,11.59 9.41,11.88 9.41,12.11
  Top 0.406: 10.73,12.52 C4.1
  Top 0.813: C4.1 v11.11,12.7 | v13.65,24.13 13.65,34.66 15.66,36.67 C1.+
  Top 1.016: v11.11,12.7 11.07,12.74 D7.C 7.03,11.79 v6.98,11.75
  Bottom 0.305: v9.68,6.03 8.41,6.03 7.14,7.3 7.14,11.11 D7.C
  Bottom 0.813: v11.11,12.7 11.11,17.16 R14.2 13.84,19.89 14.63,19.89 15.66,20.92 15.66,22.38 14.63,23.41 14.37,23.41 v13.65,24.13
  other vias: 8.78,11.79 12.87,18.92
  pour Top: 13.81,47.94 70.8,47.94 70.8,-5.24 52.7,-5.24 52.7,40.96 13.97,40.96
  pour Bottom: 13.81,47.94 70.8,47.94 70.8,-5.24 52.7,-5.24 52.7,40.96 13.97,40.96
VBUS
  Top 0.254: J7.2 29.84,9.14 29.72,9.26 29.72,10.29 29.83,10.4 29.83,12.49 29.66,12.66 29.24,12.66 IC2.7
  Top 0.305: 8.24,15.91 D7.A | IC2.7 29.1,12.8 28.23,12.8 25.17,15.86 19.14,15.86 18.84,15.56 14.26,15.56 14.1,15.72 9.01,15.72 D7.A | D7.A 7.55,15.49 5.71,13.65 4.76,13.65 J6.1
VCCA  (via drill 0.35)
  Top 0.254: C9.1 R19.2 R20.2 C37.1 25.21,29.01 26.16,29.01 26.48,28.89 v27.62,28.89 27.94,29.21 28.34,29.21 | C9.1 C10.1 | C10.1 | C10.1 C25.1 L2.2 | C9.1 27.47,34.65 U4.11 28.28,33.94 28.84,33.38 29.07,33.38 29.8,34.11 | 29.8,34.11 29.8,34.24 29.84,34.29 29.8,34.34 29.24,34.9 U4.8 | U4.4 30.65,36.32 31.21,35.75 31.21,35.52 29.8,34.11 | U4.15 28.53,30.38 27.97,29.81 27.97,29.58 28.34,29.21 | 28.34,29.21 28.58,29.21 29.14,29.77 U4.17 | U4.21 29.6,27.3 v28.58,27.3
  Bottom 0.254: v28.58,27.3 28.58,27.94 v27.62,28.89
WIZ_RST  (via drill 0.35)
  Top 0.254: U4.37 38.89,34.48 v38.89,35.08 41.89,32.08 v43.52,32.08 | IC2.22 35.37,9.53 v35.37,9.11
  Bottom 0.254: v38.89,35.08 38.89,36.28 R8.1 | v43.52,32.08 43.28,31.84 43.28,17.02 v35.37,9.11 35.37,9.5
  other vias: 36.44,38.73

### Text on the board
tPlace: 24V Passive PoE / Maglock | + - | 1 | 2 | 3 | FUSE | A3-A0 | 3v3 | GND | 13 | 4 | RST | + -
bPlace: 1 | + - | 2 | + - | 24V / Pre-Fuse | GND | 3 | + - | 4 | + -
tDocu: 0 | 1 | 2 | 3 | 4 | 5 | 6 | 7 | 8